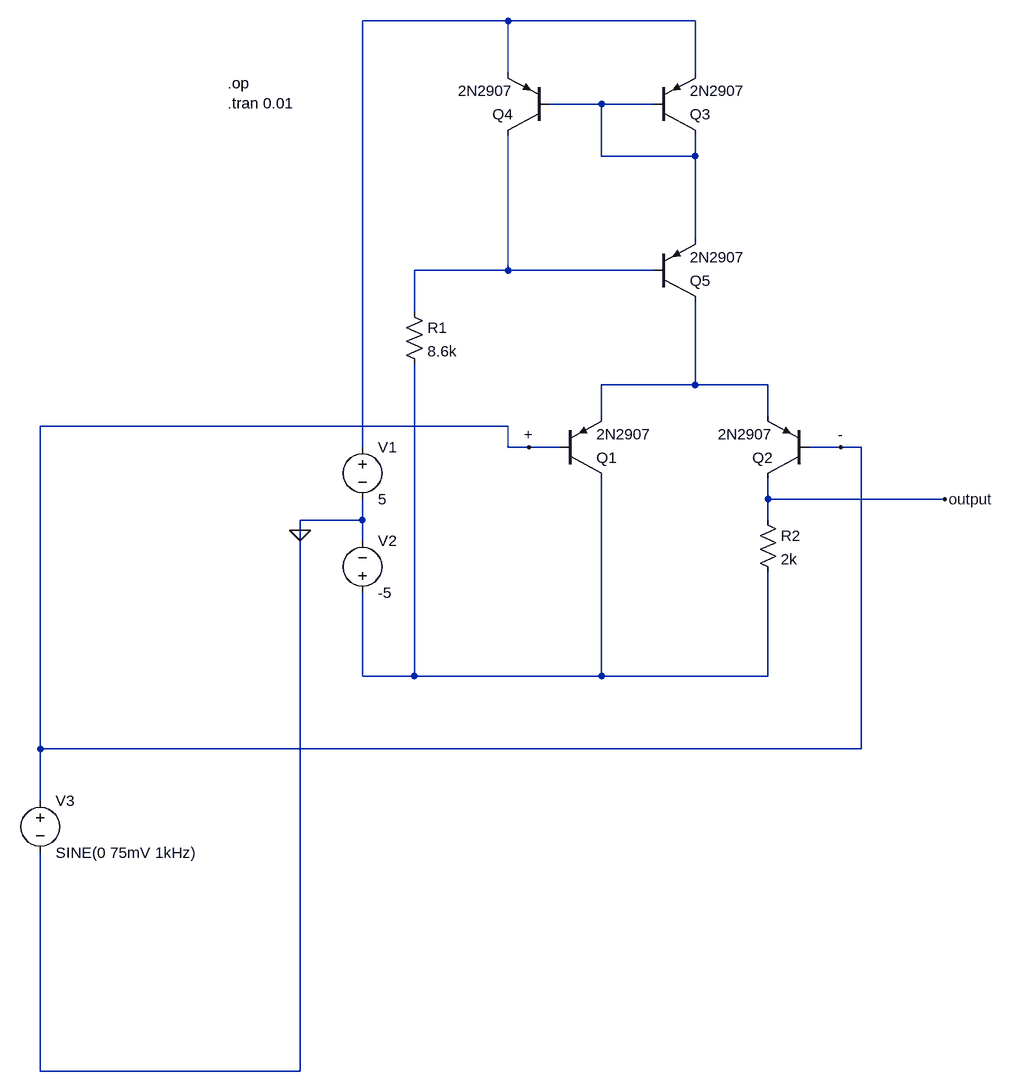
[diagram p0: schematic LTP with Wilson CM.asc]
LTP with Wilson CM.asc, the LTspice schematic file:
Version 4
SHEET 1 1100 1172
WIRE 224 -448 0 -448
WIRE 512 -448 224 -448
WIRE 224 -368 224 -448
WIRE 512 -368 512 -448
WIRE 368 -320 288 -320
WIRE 448 -320 368 -320
WIRE 368 -240 368 -320
WIRE 512 -240 512 -272
WIRE 512 -240 368 -240
WIRE 512 -112 512 -240
WIRE 224 -64 224 -272
WIRE 224 -64 80 -64
WIRE 448 -64 224 -64
WIRE 80 0 80 -64
WIRE 512 112 512 -16
WIRE 512 112 368 112
WIRE 624 112 512 112
WIRE 368 160 368 112
WIRE 624 160 624 112
WIRE 224 176 -496 176
WIRE 0 208 0 -448
WIRE 224 208 224 176
WIRE 256 208 224 208
WIRE 304 208 256 208
WIRE 736 208 688 208
WIRE 768 208 736 208
WIRE 624 288 624 256
WIRE 896 288 624 288
WIRE 0 320 0 288
WIRE 0 320 -96 320
WIRE 624 320 624 288
WIRE -96 336 -96 320
WIRE 0 352 0 320
WIRE 0 560 0 432
WIRE 80 560 80 80
WIRE 80 560 0 560
WIRE 368 560 368 256
WIRE 368 560 80 560
WIRE 624 560 624 400
WIRE 624 560 368 560
WIRE -496 672 -496 176
WIRE 768 672 768 208
WIRE 768 672 -496 672
WIRE -496 752 -496 672
WIRE -496 1168 -496 832
WIRE -96 1168 -96 336
WIRE -96 1168 -496 1168
FLAG -96 336 0
FLAG 896 288 output
FLAG 736 208 -
FLAG 256 208 +
SYMBOL pnp 304 256 M180
SYMATTR InstName Q1
SYMATTR Value 2N2907
SYMBOL pnp 688 256 R180
SYMATTR InstName Q2
SYMATTR Value 2N2907
SYMBOL voltage 0 192 R0
SYMATTR InstName V1
SYMATTR Value 5
SYMBOL voltage 0 448 M180
WINDOW 0 24 96 Left 2
WINDOW 3 24 16 Left 2
SYMATTR InstName V2
SYMATTR Value -5
SYMBOL pnp 448 -272 M180
SYMATTR InstName Q3
SYMATTR Value 2N2907
SYMBOL pnp 288 -272 R180
SYMATTR InstName Q4
SYMATTR Value 2N2907
SYMBOL pnp 448 -16 M180
SYMATTR InstName Q5
SYMATTR Value 2N2907
SYMBOL res 64 -16 R0
SYMATTR InstName R1
SYMATTR Value 8.6k
SYMBOL res 608 304 R0
SYMATTR InstName R2
SYMATTR Value 2k
SYMBOL voltage -496 736 R0
SYMATTR InstName V3
SYMATTR Value SINE(0 75mV 1kHz)
TEXT -208 -352 Left 2 !.op\n.tran 0.01

The netlist it stands for:
* LTP with Wilson CM.asc
Q1 N005 + N004 0 2N2907
Q2 output + N004 0 2N2907
V1 N001 0 5
V2 N005 0 -5
Q3 N002 N002 N001 0 2N2907
Q4 N003 N002 N001 0 2N2907
Q5 N004 N003 N002 0 2N2907
R1 N003 N005 8.6k
R2 output N005 2k
V3 + 0 SINE(0 75mV 1kHz)
.model NPN NPN
.model PNP PNP
.lib standard.bjt
.op
.tran 0.01
.backanno
.end